# EAGLE design gpi-viper (EAGLE 7.2.0)
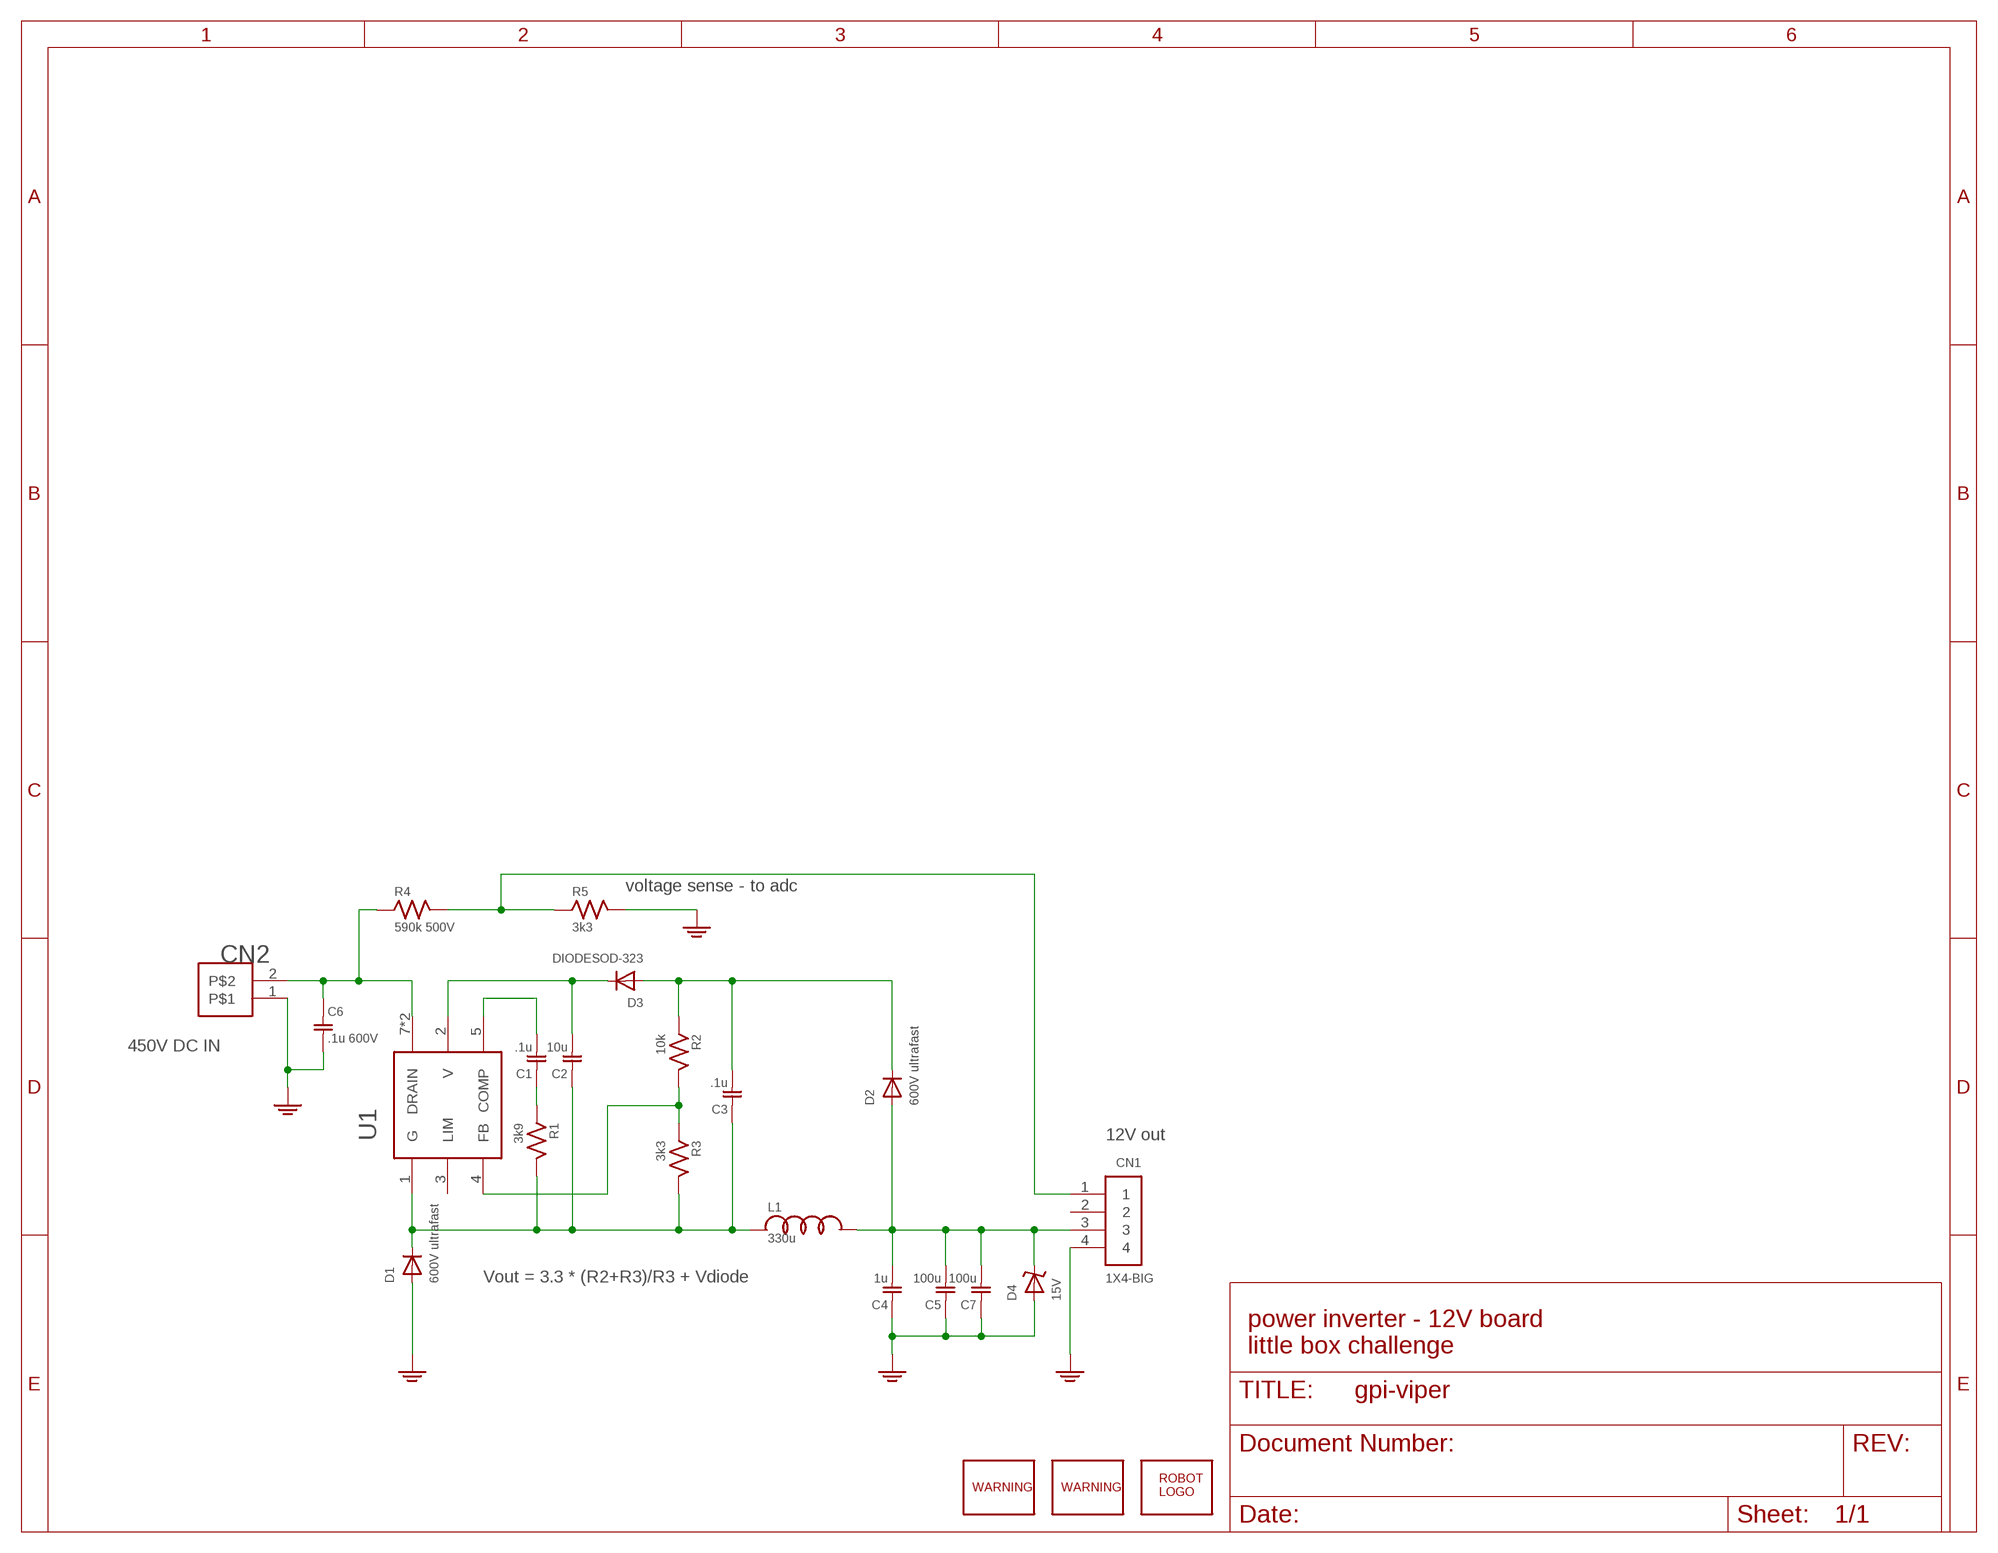
[diagram p0: schematic, sheet 1]

## Parts
C1  .1u  C0603  [SMD0603]
C2  10u  C0603  [SMD0603]
C3  .1u  C0603  [SMD0603]
C4  1u  C0603  [SMD0603]
C5  100u  C1210  [SMD1210]
C6  .1u 600V  C1210  [SMD1210]
C7  100u  C1210  [SMD1210]
CN1  1X4-BIG  [1X04-BIG]
CN2  HEADER-1X2.4  [HEADER-1X2-THM-WIDE]
D1  600V ultrafast  DIODEDO-214AC  [DO-214AC]
D2  600V ultrafast  DIODEDO-214AC  [DO-214AC]
D3  DIODESOD-323  [SOD-323]
D4  15V  ZENER  [SOD-323@1]
L1  330u  L2100  [BOURNS2100]
R1  3k9  R0603  [SMD0603]
R2  10k  R0603  [SMD0603]
R3  3k3  R0603  [SMD0603]
R4  590k 500V  R1206  [SMD1206]
R5  3k3  R0603  [SMD0603]
U1  VIPER26DIP7  [VIPER26-P7]
U$1  ROBOTMAN-LOGO  [ROBOTMAN-LOGO]
U$2  SYMBOL-WARNING  [SYMBOL-WARNING]
U$3  SYMBOL-WARNING  [SYMBOL-WARNING]

## Nets
GND: C4.1 C5.1 C6.2 C7.1 CN1.4 CN2.1 D1.A D4.A R5.2 ; supply symbol labelled PWR-GND
N$1: C1.1 R1.1
N$2: C2.1 C3.1 D1.C L1.P$1 R1.2 R3.2 U1.1(G)
N$3: C1.2 U1.5(COMP)
N$4: C2.2 D3.C U1.2(V)
N$6: C3.2 D2.C D3.A R2.1
N$7: R2.2 R3.1 U1.4(FB)
N$9: C6.1 CN2.2 R4.1 U1.7(DRAIN) U1.8(DRAIN)
N$12: CN1.1 R4.2 R5.1
VOUT: C4.2 C5.2 C7.2 CN1.3 D2.A D4.C L1.P$2
Unconnected: CN1.2 U1.3(LIM)

## Notes on the sheet
- voltage sense - to adc
- 450V DC IN
- 12V out
- Vout = 3.3 * (R2+R3)/R3 + Vdiode
- power inverter - 12V board
  little box challenge

## Library data of the parts
C1-C7 = jaw:C
CN1 = adafruit:1X4: 4-pin connector
CN2 = jaw:HEADER-1X2
D1-D3 = jaw:DIODE
D4 = jaw:ZENER
L1 = jaw:L
R1-R5 = jaw:R
U1 = jaw:VIPER26
U$1 = jaw:ROBOTMAN-LOGO
U$2 U$3 = jaw:SYMBOL-WARNING

## Board
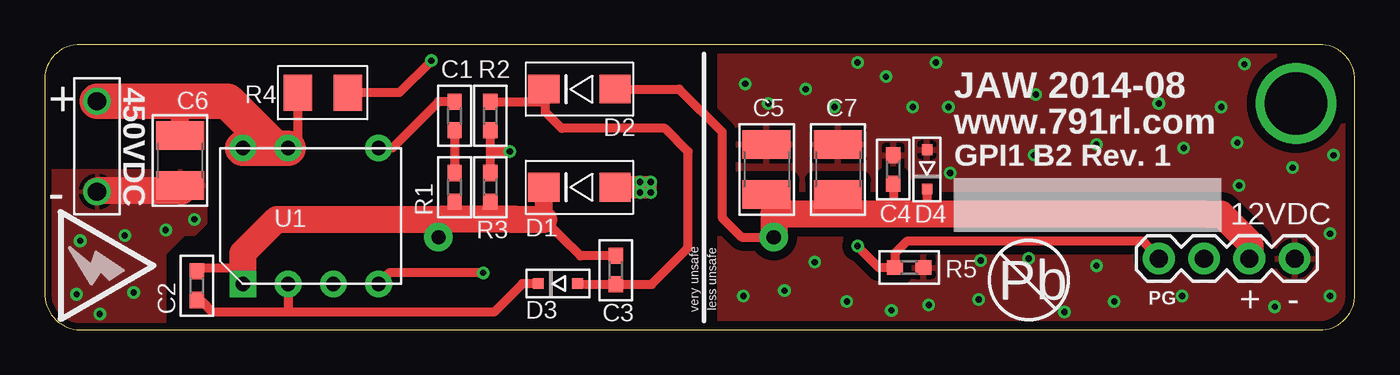
[diagram p1: board, top side]
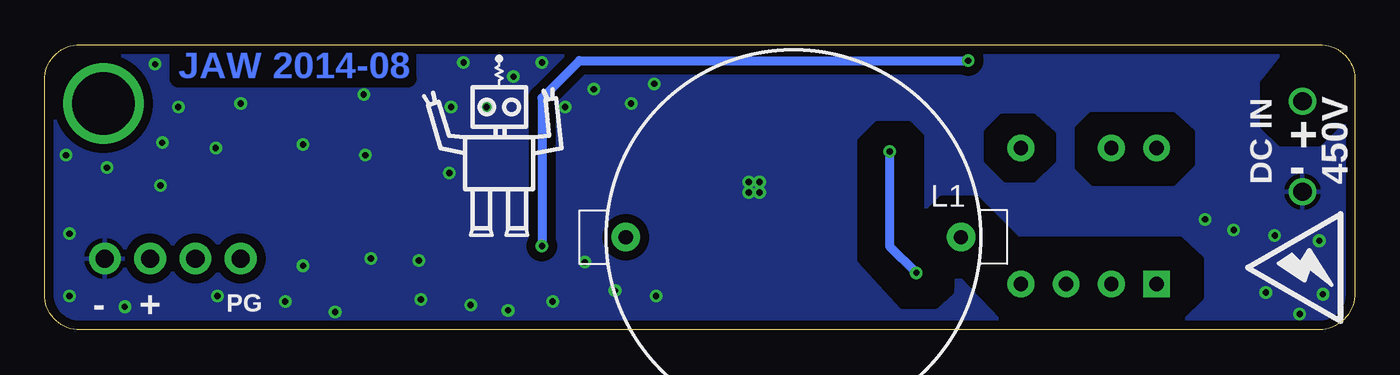
[diagram p2: board, bottom side, seen from below]

Size 73.5 x 16 mm. Coordinates in mm from the lower left corner, seen from the top.
Outline: 71.5,16 2,16 arc90 0,14.1 0,2.1 arc90 2,0 71.5,0 arc90 73.5,2 73.5,14 arc90 71.5,16
Copper layers (1*16): Top 0.0356mm / dielectric 1.5011mm / Bottom 0.0356mm
Design rules "LaenPCBOrder *": minimum track width 6mil, minimum drill 13mil, track to track 6mil, track to pad 6mil, pad to pad 6mil, via to via 6mil, smd to smd 6mil, copper to edge 15mil, drill to drill 6mil, minimum pad ring 7mil, minimum via ring 7mil, stop-mask expansion 4mil, vias tented up to drill 0.4mm, thermal gap 10mil

### Footprints (pad centres in the part's own frame; a part is rotated, then mirrored left to right if it is on the bottom)
SMD0603 = smd 0.9 x 0.8: 1 -0.8,0; 2 0.8,0
SMD1210 = smd 1.6 x 2.7: 1 -1.4,0; 2 1.4,0
1X04-BIG = drill 1.016 pad 1.778: 1 0,0; 2 2.54,0; 3 5.08,0; 4 7.62,0
HEADER-1X2-THM-WIDE = drill 1.016: 1 -2.54,0; 2 2.54,0
DO-214AC = smd 1.75 x 1.6: A -2,0; C 2,0
SOD-323 = smd 0.6 x 0.6: A 1.1,0; C -1.1,0
SOD-323@1 = smd 0.6 x 0.6: A 1.1,0; C -1.1,0
BOURNS2100 = drill 0.8 pad 1.6: P$1 -9.4,0; P$2 9.4,0
SMD1206 = smd 1.6 x 2: 1 -1.4,0; 2 1.4,0
VIPER26-P7 = drill 0.8 pad 1.5 square: 1 -3.81,3.81 | drill 0.8 pad 1.5: 2 -3.81,1.27; 3 -3.81,-1.27; 4 -3.81,-3.81; 5 3.81,-3.81; 7 3.81,1.27; 8 3.81,3.81

### Placement (x,y rotation side)
C1  23,12 90 top
C2  8.54,2.48 270 top
C3  32.04,3.35 270 top
C4  47.6,9 270 top
C5  40.5,9 270 top
C6  7.6,9.5 270 top
C7  44.5,9 270 top
CN1  62.5,4 0 top
CN2  2.94,10.29 90 top
D1  30,8 180 top
D2  30,13.5 180 top
D3  28.8,2.6 0 top
D4  49.5,9 90 top
L1  31.5,5.2 180 bottom
R1  23,8 270 top
R2  25,12 270 top
R3  25,8 270 top
R4  15.6,13.3 0 top
R5  48.5,3.5 0 top
U1  14.93,6.39 90 top
U$1  48,9.6 0 bottom
U$2  2.9,3.6 270 top
U$3  2.8,3.5 90 bottom

### Tracks (layer width: path | path; a pad name or v marks a point on that pad's centre or on a via)
GND  (via drill 0.35)
  Top 0.5: v34,7.7 33.7,8
  Top 1.25: D1.A 33.7,8
  Top 1.5: 7.7,7.8 4.3,7.8 2.9,7.8
  other vias: 8.4,6.2 59,3.6 55.2,4 63.8,1.9 57.2,1 45.6,15 67.3,14.9 52.5,3.9 49.6,1.4 4.5,5.3 72.3,9.8 47.5,1.1 2,5 52.4,1.7 69,1.3 1.8,2 33.4,8.3 39.2,1.9 39.3,13.8 40.6,12.7 43.2,3.8 41.5,2.2 45,1.6 3.1,0.9 44.3,12.5 48.7,12.5 50.8,8.8 50,15 47.2,14.2 50.7,12.5 55.6,13.2 55.5,9.8 62.5,12.7 63.9,10.2 59,10.4 66,12.5 66.9,10.5 67,8.1 70,9.1 72.1,1.9 72.1,5.4 60,1.6 6.8,5.6 5,2.1 34,8.3 33.4,7.7 42.7,13.5
  pour Bottom (isolate 0.5): 0,16 73.5,16 73.5,0 0.1,0
  pour Top (isolate 0.5): 37.9,16 73.5,16 73.5,0 37.9,0
  pour Top (isolate 0.25): -0.4,8.9 9,8.9 9,6 8.4,5.4 7.8,5.4 6.7,4.3 6.7,-0.3 -0.4,-0.3
N$1
  Top 0.5: C1.1 R1.1
N$2
  Top 0.5: 11.12,3.18 U1.1 | R1.2 22.6,6.2 | R3.2 25,6.23 26.2,6.2 | C2.1 8.66,3.5 11.12,3.5 | 28,6.2 28.95,5.25 | 28.95,5.25 29.2,5 | C3.1 30.05,4.15 28.95,5.25
  Top 1: D1.C 28,6.2
  Top 1.5: 11.12,3.18 11.12,3.5 11.12,4.3 13.02,6.2 22.6,6.2 | 26.5,6.2 26.2,6.2 26.5,6.2 | 26.5,6.2 28,6.2 | L1.P$1 22.1,6.1 | 22.1,6.1 22.1,6.2 | 26.5,6.2 22.6,6.2 | 22.6,6.2 22.2,6.2 22.1,6.1
N$3
  Top 0.5: C1.2 22.1,12.8 19.5,10.2 U1.5
N$4
  Top 0.5: 13.5,1 25.2,1 26.8,2.6 D3.C | 13.5,1 9.4,1 8.82,1.6 C2.2 | U1.2 13.66,1.16 13.5,1
N$5
  cutout Bottom: 1.6,15.4 4,15.4 5.2,13.9 5.2,11.4 4.2,10.4 2,10.4 0.7,11.7 0.7,14
N$6
  Top 0.5: 28.1,12.8 28.1,12.2 29,11.3 34.8,11.3 36.1,10 36.1,4.6 34.05,2.55 C3.2 30.35,2.55 D3.A | R2.1 28.1,12.8 | 28.1,12.8 D2.C
N$7  (via drill 0.35)
  Top 0.5: v26.1,10 25,10 | R2.2 25,10 | 25,10 R3.1 | v24.6,3.2 19.32,3.2 U1.4
  Bottom 0.5: v26.1,10 26.1,4.7 v24.6,3.2
N$8
  cutout Bottom: 14.8,12.1 10.2,12.1 9.1,11.1 9.1,9.3 10.2,8.2 14.7,8.2 15.6,9.1 15.6,11.3
N$9
  Top 0.5: R4.1 14.2,10.24 U1.7
  Top 1: C6.1 7.6,12.83
  Top 2: CN2.2 7.6,12.83 8.52,12.83 10.27,12.83 12.9,10.2 | U1.8 12.9,10.2 | 12.9,10.2 U1.7
N$10  (via drill 3.5)
  other vias: 70.2,12.7
N$11
  cutout Bottom: 9.8,5.1 18.9,5.1 21.2,7.4 23.2,7.4 24.2,6.4 24.2,4 23.1,3 22,3 19.8,0.7 9.7,0.7 8.6,1.8 8.6,4
N$12  (via drill 0.35)
  Top 0.5: v45.6,4.7 46.8,3.5 R5.1 47.7,4.3 48.4,5 61.6,5 CN1.1 | v21.7,15.1 19.9,13.3 R4.2
  Bottom 0.5: v21.7,15.1 43.5,15.1 45.6,13 v45.6,4.7
N$13
  cutout Bottom: 18,12 16.9,11 16.9,9.5 18,8.4 19.6,8.4 20.7,9.5 20.7,11.1 19.8,12
N$14
  cutout Bottom: 24.3,10.9 25,11.6 26.8,11.6 27.8,10.6 27.8,3.9 25.4,1.3 23.5,1.3 22.6,2.1 22.5,4 24.3,5.9
VOUT
  Top 0.5: 51,6.6 51.1,6.5 | 53,6.6 53.1,6.5 | D2.A 31.4,13.5 35.6,13.5 38,11.1 38,8.7 38,6.3 39.1,5.2 L1.P$2 | 43.4,6.6 43.5,6.5 | C5.2 40.9,7.5 40.9,6.5 | C4.2 47.6,6.5 | D4.C 49.5,6.5
  Top 1: C7.2 44.5,6.6 44.4,6.5
  Top 1.5: L1.P$2 40.9,6.5 43.5,6.5 44.4,6.5 47.6,6.5 49.5,6.5 51,6.5 51.1,6.5 53.1,6.5 65.08,6.5 66,6.5 67.6,4.9 67.6,4.02 CN1.3

### Text on the board
Bottom: JAW 2014-08
tPlace: 450VDC | JAW 2014-08 | + | www.791rl.com | GPI1 B2 Rev. 1 | - | 12VDC | Pb | very unsafe | less unsafe | PG | + | -
bPlace: 450V | DC IN | + | - | PG | + | -
bStop: JAW 2014-08